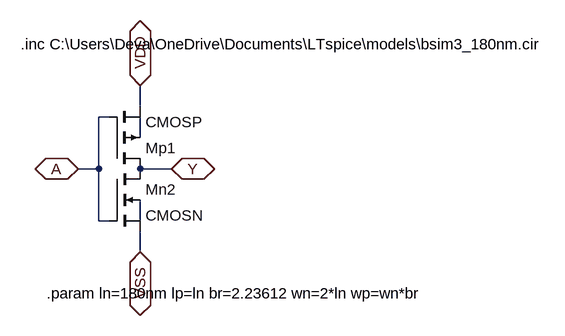
[diagram p0: schematic inv1x.asc]
inv1x.asc, the LTspice schematic file:
Version 4.1
SHEET 1 880 680
WIRE 192 48 192 16
WIRE 144 64 128 64
WIRE 192 96 192 64
WIRE 128 144 128 64
WIRE 128 144 96 144
WIRE 240 144 192 144
WIRE 128 224 128 144
WIRE 144 224 128 224
WIRE 192 224 192 192
WIRE 192 272 192 240
FLAG 240 144 Y
IOPIN 240 144 BiDir
FLAG 96 144 A
IOPIN 96 144 BiDir
FLAG 192 16 VDD
IOPIN 192 16 BiDir
FLAG 192 272 VSS
IOPIN 192 272 BiDir
SYMBOL pmos4 144 144 M180
SYMATTR InstName Mp1
SYMATTR Value CMOSP
SYMATTR Value2 l={lp} w={wp} ad={lp*wp} as={lp*wp} pd={2*lp+wp} ps={2*lp+wp}
SYMBOL nmos4 144 144 R0
SYMATTR InstName Mn2
SYMATTR Value CMOSN
SYMATTR Value2 l={ln} w={wn} ad={ln*wn} as={ln*wn} pd={2*ln+wn} ps={2*ln+wn}
TEXT 8 -48 Left 2 !.inc C:\\Users\\Deva\\OneDrive\\Documents\\LTspice\\models\\bsim3_180nm.cir
TEXT 48 336 Left 2 !.param ln=180nm lp=ln br=2.23612 wn=2*ln wp=wn*br

The netlist it stands for:
* inv1x.asc
Mp1 Y A VDD N001 CMOSP l={lp} w={wp} ad={lp*wp} as={lp*wp} pd={2*lp+wp} ps={2*lp+wp}
Mn2 Y A VSS N002 CMOSN l={ln} w={wn} ad={ln*wn} as={ln*wn} pd={2*ln+wn} ps={2*ln+wn}
.model NMOS NMOS
.model PMOS PMOS
.lib standard.mos
.inc C:\Users\Deva\OneDrive\Documents\LTspice\models\bsim3_180nm.cir
.param ln=180nm lp=ln br=2.23612 wn=2*ln wp=wn*br
.backanno
.end